# Altium schematic sheet STM32.SchDoc
size A3
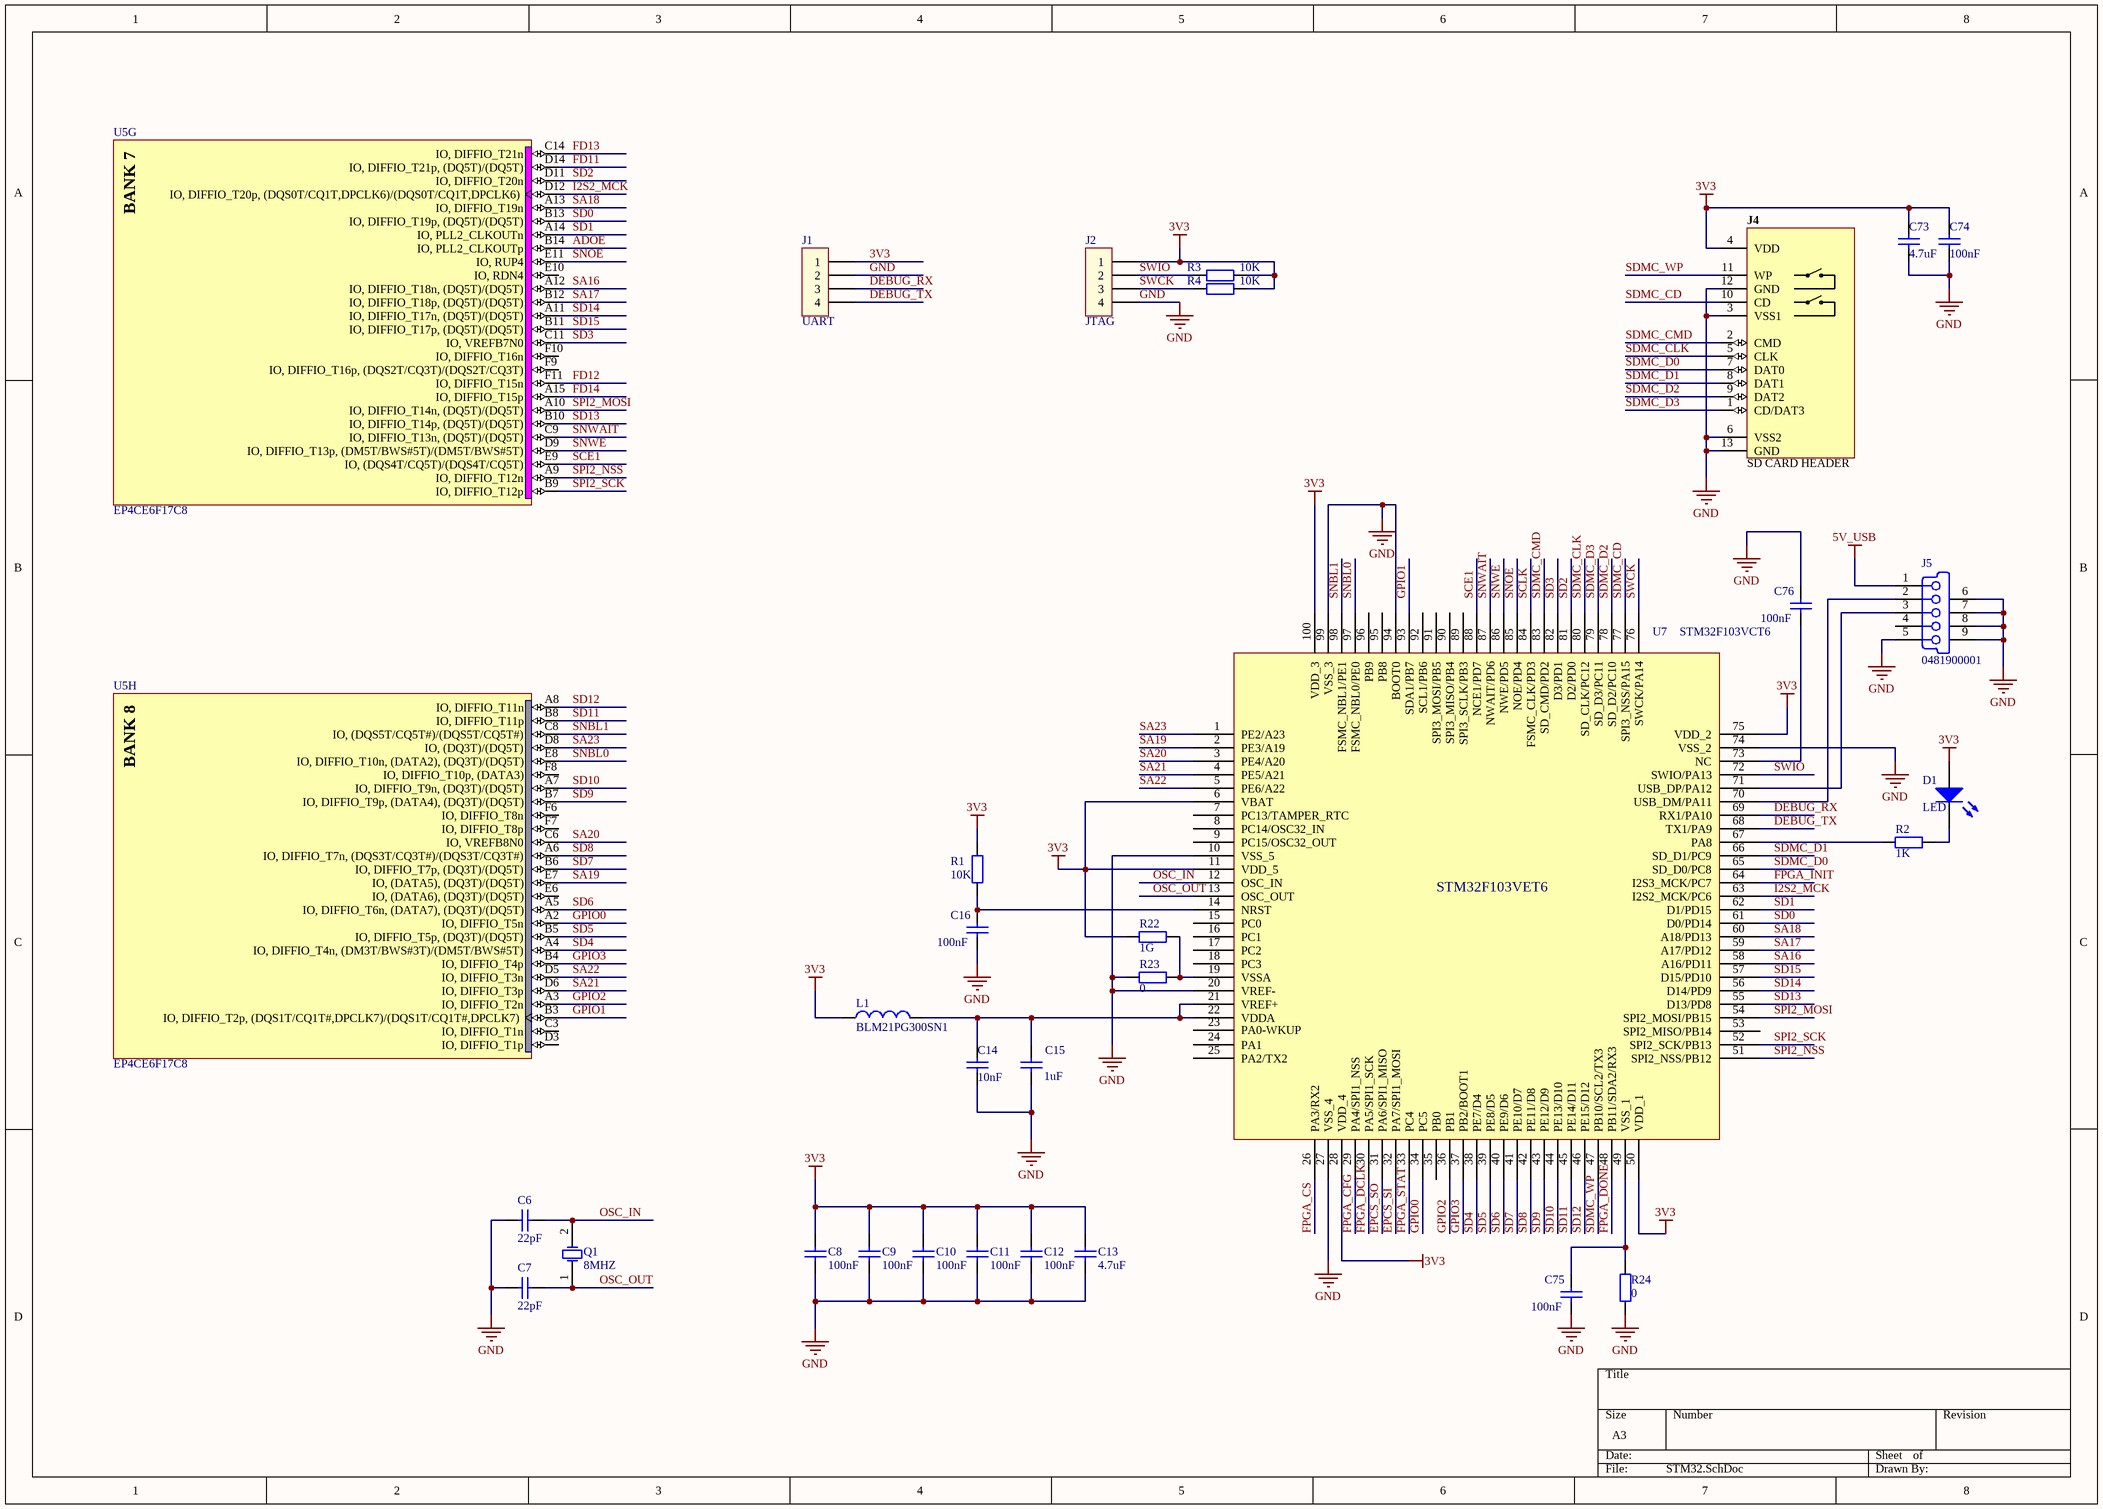
[diagram p0: STM32.SchDoc]

## Parts
C6  22pF  [C0603]
C7  22pF  [C0603]
C8  100nF  [C0603]
C9  100nF  [C0603]
C10  100nF  [C0603]
C11  100nF  [C0603]
C12  100nF  [C0603]
C13  4.7uF  [C0603]
C14  10nF  [C0603]
C15  1uF  [C0603]
C16  100nF  [C0603]
C73  4.7uF  [C0603]
C74  100nF  [C0603]
C75  100nF  [C0603]
C76  100nF  [C0603]
D1  LED  [D0603]
J1  UART  [SIP4]
J2  JTAG  [SIP4]
J4  SD CARD HEADER  [KSDC012551]
J5  0481900001  [Micro USB]
L1  BLM21PG300SN1  [R0805]
Q1  8MHZ  [SMD_CRYSTAL]
R1  10K  [R0603]
R2  1K  [R0603]
R3  10K  [R0603]
R4  10K  [R0603]
R22  1G  [R0603]
R23  0  [R0603]
R24  0  [R0603]
U5  EP4CE6F17C8  [FBGA256]  (parts G,H of 13)
U7  STM32F103VCT6  [TQFP-100]

## Nets
3V3: C8.2 C9.2 C10.2 C11.2 C12.2 C13.2 C73.2 C74.2 D1.1 J1.1 J2.1 J4.4(VDD) L1.1 R1.2 R3.2 R4.2 R22.2 U7.6(VBAT) U7.11(VDD_5) U7.28(VDD_4) U7.50(VDD_1) U7.75(VDD_2) U7.100(VDD_3)
5V_USB: J5.1(V_BUS_(5V))
GND: C6.2 C7.2 C8.1 C9.1 C10.1 C11.1 C12.1 C13.1 C14.1 C15.1 C16.2 C73.1 C74.1 C75.2 C76.1 J1.2 J2.4 J4.3(VSS1) J4.6(VSS2) J4.12(GND) J4.13(GND) J5.5(GND) J5.6(Tab) J5.7(Tab) J5.8(Tab) J5.9(Tab) R23.2 R24.2 U7.10(VSS_5) U7.20(VREF-) U7.27(VSS_4) U7.74(VSS_2) U7.94(BOOT0) U7.99(VSS_3)
ADOE: U5.B14(IO,_PLL2_CLKOUTp)
DEBUG_RX: J1.3 U7.69(RX1/PA10)
DEBUG_TX: J1.4 U7.68(TX1/PA9)
EPCS_SI: U7.32(PA7/SPI1_MOSI)
EPCS_SO: U7.31(PA6/SPI1_MISO)
FD11: U5.D14(IO,_DIFFIO_T21p,_(DQ5T)/(DQ5T))
FD12: U5.F11(IO,_DIFFIO_T15n)
FD13: U5.C14(IO,_DIFFIO_T21n)
FD14: U5.A15(IO,_DIFFIO_T15p)
FPGA_CFG: U7.29(PA4/SPI1_NSS)
FPGA_CS: U7.26(PA3/RX2)
FPGA_DCLK: U7.30(PA5/SPI1_SCK)
FPGA_DONE: U7.48(PB11/SDA2/RX3)
FPGA_INIT: U7.64(I2S3_MCK/PC7)
FPGA_STAT: U7.33(PC4)
GPIO0: U5.A2(IO,_DIFFIO_T5n) U7.34(PC5)
GPIO1: U5.B3(IO,_DIFFIO_T2p,_(DQS1T/CQ1T#,DPCLK7)/(DQS1T/CQ1T#,DPCLK7)) U7.93(SDA1/PB7)
GPIO2: U5.A3(IO,_DIFFIO_T2n) U7.36(PB1)
GPIO3: U5.B4(IO,_DIFFIO_T4p) U7.37(PB2/BOOT1)
I2S2_MCK: U5.D12(IO,_DIFFIO_T20p,_(DQS0T/CQ1T,DPCLK6)/(DQS0T/CQ1T,DPCLK6)) U7.63(I2S2_MCK/PC6)
OSC_IN: C6.1 Q1.2(OSC2) U7.12(OSC_IN)
OSC_OUT: C7.1 Q1.1(OSC1) U7.13(OSC_OUT)
SA16: U5.A12(IO,_DIFFIO_T18n,_(DQ5T)/(DQ5T)) U7.58(A16/PD11)
SA17: U5.B12(IO,_DIFFIO_T18p,_(DQ5T)/(DQ5T)) U7.59(A17/PD12)
SA18: U5.A13(IO,_DIFFIO_T19n) U7.60(A18/PD13)
SA19: U5.E7(IO,_(DATA5),_(DQ3T)/(DQ5T)) U7.2(PE3/A19)
SA20: U5.C6(IO,_VREFB8N0) U7.3(PE4/A20)
SA21: U5.D6(IO,_DIFFIO_T3p) U7.4(PE5/A21)
SA22: U5.D5(IO,_DIFFIO_T3n) U7.5(PE6/A22)
SA23: U5.D8(IO,_(DQ3T)/(DQ5T)) U7.1(PE2/A23)
SCE1: U5.E9(IO,_(DQS4T/CQ5T)/(DQS4T/CQ5T)) U7.88(NCE1/PD7)
SCLK: U7.84(FSMC_CLK/PD3)
SD0: U5.B13(IO,_DIFFIO_T19p,_(DQ5T)/(DQ5T)) U7.61(D0/PD14)
SD1: U5.A14(IO,_PLL2_CLKOUTn) U7.62(D1/PD15)
SD2: U5.D11(IO,_DIFFIO_T20n) U7.81(D2/PD0)
SD3: U5.C11(IO,_VREFB7N0) U7.82(D3/PD1)
SD4: U5.A4(IO,_DIFFIO_T4n,_(DM3T/BWS#3T)/(DM5T/BWS#5T)) U7.38(PE7/D4)
SD5: U5.B5(IO,_DIFFIO_T5p,_(DQ3T)/(DQ5T)) U7.39(PE8/D5)
SD6: U5.A5(IO,_DIFFIO_T6n,_(DATA7),_(DQ3T)/(DQ5T)) U7.40(PE9/D6)
SD7: U5.B6(IO,_DIFFIO_T7p,_(DQ3T)/(DQ5T)) U7.41(PE10/D7)
SD8: U5.A6(IO,_DIFFIO_T7n,_(DQS3T/CQ3T#)/(DQS3T/CQ3T#)) U7.42(PE11/D8)
SD9: U5.B7(IO,_DIFFIO_T9p,_(DATA4),_(DQ3T)/(DQ5T)) U7.43(PE12/D9)
SD10: U5.A7(IO,_DIFFIO_T9n,_(DQ3T)/(DQ5T)) U7.44(PE13/D10)
SD11: U5.B8(IO,_DIFFIO_T11p) U7.45(PE14/D11)
SD12: U5.A8(IO,_DIFFIO_T11n) U7.46(PE15/D12)
SD13: U5.B10(IO,_DIFFIO_T14p,_(DQ5T)/(DQ5T)) U7.55(D13/PD8)
SD14: U5.A11(IO,_DIFFIO_T17n,_(DQ5T)/(DQ5T)) U7.56(D14/PD9)
SD15: U5.B11(IO,_DIFFIO_T17p,_(DQ5T)/(DQ5T)) U7.57(D15/PD10)
SDMC_CD: J4.10(CD) U7.77(SPI3_NSS/PA15)
SDMC_CLK: J4.5(CLK) U7.80(SD_CLK/PC12)
SDMC_CMD: J4.2(CMD) U7.83(SD_CMD/PD2)
SDMC_D0: J4.7(DAT0) U7.65(SD_D0/PC8)
SDMC_D1: J4.8(DAT1) U7.66(SD_D1/PC9)
SDMC_D2: J4.9(DAT2) U7.78(SD_D2/PC10)
SDMC_D3: J4.1(CD/DAT3) U7.79(SD_D3/PC11)
SDMC_WP: J4.11(WP) U7.47(PB10/SCL2/TX3)
SNBL0: U5.E8(IO,_DIFFIO_T10n,_(DATA2),_(DQ3T)/(DQ5T)) U7.97(FSMC_NBL0/PE0)
SNBL1: U5.C8(IO,_(DQS5T/CQ5T#)/(DQS5T/CQ5T#)) U7.98(FSMC_NBL1/PE1)
SNOE: U5.E11(IO,_RUP4) U7.85(NOE/PD4)
SNWAIT: U5.C9(IO,_DIFFIO_T13n,_(DQ5T)/(DQ5T)) U7.87(NWAIT/PD6)
SNWE: U5.D9(IO,_DIFFIO_T13p,_(DM5T/BWS#5T)/(DM5T/BWS#5T)) U7.86(NWE/PD5)
SPI2_MOSI: U5.A10(IO,_DIFFIO_T14n,_(DQ5T)/(DQ5T)) U7.54(SPI2_MOSI/PB15)
SPI2_NSS: U5.A9(IO,_DIFFIO_T12n) U7.51(SPI2_NSS/PB12)
SPI2_SCK: U5.B9(IO,_DIFFIO_T12p) U7.52(SPI2_SCK/PB13)
SWCK: J2.3 R4.1 U7.76(SWCK/PA14)
SWIO: J2.2 R3.1 U7.72(SWIO/PA13)
NetC14_2: C14.2 C15.2 L1.2 U7.21(VREF+) U7.22(VDDA)
NetC16_1: C16.1 R1.1 U7.14(NRST)
NetC75_1: C75.1 R24.1 U7.49(VSS_1)
NetC76_2: C76.2 U7.73(NC)
NetD1_2: D1.2 R2.1
NetJ5_2: J5.2(D-) U7.70(USB_DM/PA11)
NetJ5_3: J5.3(D+) U7.71(USB_DP/PA12)
NetR2_2: R2.2 U7.67(PA8)
NetR22_1: R22.1 R23.1 U7.19(VSSA)

Not connected (* = marked no-connect by the designer): J5 4(NC); U5 C3(IO,_DIFFIO_T1n) D3(IO,_DIFFIO_T1p) E6(IO,_(DATA6),_(DQ3T)/(DQ5T)) E10(IO,_RDN4) F6(IO,_DIFFIO_T8n) F7(IO,_DIFFIO_T8p) F8(IO,_DIFFIO_T10p,_(DATA3)) F9(IO,_DIFFIO_T16p,_(DQS2T/CQ3T)/(DQS2T/CQ3T)) F10(IO,_DIFFIO_T16n); U7 7(PC13/TAMPER_RTC) 8(PC14/OSC32_IN) 9(PC15/OSC32_OUT) 15(PC0) 16(PC1) 17(PC2) 18(PC3) 23(PA0-WKUP) 24(PA1) 25(PA2/TX2) 35(PB0) 53(SPI2_MISO/PB14) 89(SPI3_SCLK/PB3) 90(SPI3_MISO/PB4) 91(SPI3_MOSI/PB5) 92(SCL1/PB6) 95(PB8) 96(PB9)

## Notes on the sheet
- (in symbol EP4CE6F17C8, part G) BANK 7
- (in symbol EP4CE6F17C8, part H) BANK 8
- (in symbol STM32F103VCT6) STM32F103VET6

## Library data of the parts
C6-C16 C73-C76 = Cap: Capacitor; Published: 8-Jun-2000; LatestRevisionDate: 17-Jul-2002; LatestRevisionNote: Re-released for DXP Platform.; PackageReference: RAD-0.3; Publisher: Altium Limited
D1 = LED1: Typical RED GaAs LED; Published: 8-Jun-2000; LatestRevisionDate: 08-Jul-2005; LatestRevisionNote: Mech Layer 1 removed.; PackageReference: LED-1; Publisher: Altium Limited
J1 J2 = SIP4
J4 = KSDC012551-9: Secure Digital Card Socket; Max Current: mA; Connector type: Header; Mounting Technology: Surface Mount; Status: Production; Category: Connector
J5 = 0481900001: USB On-The-Go (OTG) Mini-B Receptacle, Right Angle, SMT, 0.80mm (.031") Pitch, Solder Tabs with Back Cover, Recessed Type; PCB_Layout: Complies with Manufacturer's Recommendation.; Published: 21-Sep-2007; DatasheetVersion: revA, May-2004; PackageVersion: May-2004; PackageReference: 481900001; Publisher: Altium Limited; PackageDescription: USB Mini-B, Sinking Type, SM; 5 Position; Right Angle, Body 11.45 x 11.8 x 3.9 mm (LxWxH); ComponentLink1Description: Manufacturer Link; ComponentLink1URL: http://www.molex.com/; ComponentLink2Description: Datasheet; ComponentLink2URL: http://www.molex.com/cmc_upload/0/000/895/958/SD-48190-001RevA.pdf
L1 = Inductor: Code_IEC: 1005; Published: 8-Jun-2000; LatestRevisionDate: 17-Jul-2002; LatestRevisionNote: Re-released for DXP Platform.; PackageReference: 0402-A; Publisher: Altium Limited; Code_JEITA: 0402
Q1 = XTAL: Crystal Oscillator; Published: 8-Jun-2000; LatestRevisionDate: 17-Jul-2002; LatestRevisionNote: Re-released for DXP Platform.; PackageReference: R38; Publisher: Altium Limited
R1-R4 R22-R24 = Res2: Resistor; Published: 8-Jun-2000; LatestRevisionDate: 17-Jul-2002; LatestRevisionNote: Re-released for DXP Platform.; PackageReference: AXIAL-0.4; Publisher: Altium Limited
U5 = EP4CE6F17C8: Cyclone IV Family FPGA, 2V Core, 179 I/O Pins, 2 PLLs, 256-Pin FBGA, Speed Grade 8, Commercial Grade; Published: 3-May-2010; DatasheetVersion: ver1.2, Mar-2010; PackageVersion: ver16.0, Dec-2009; PackageReference: FBGA256; Publisher: Altium Limited; PackageDescription: 256-Ball FineLine Ball Grid Array (FBGA256) - Option 1 - Wire Bond; Code_JEDEC: MS-034-AAF-1; Code_IPC: BGA100P16X16-256; ComponentLink1Description: Manufacturer Link; ComponentLink1URL: http://www.altera.com/; ComponentLink2Description: Handbook; ComponentLink2URL: http://www.altera.com/literature/hb/cyclone-iv/cyclone4-handbook.pdf; ComponentLink3Description: Pinout Specification; ComponentLink3URL: http://www.altera.com/literature/lit-dp.jsp?category=cyc%204&showspreadsheet=y; ComponentLink4Description: Packaging Specification; ComponentLink4URL: http://www.altera.com/literature/ds/dspkg.pdf